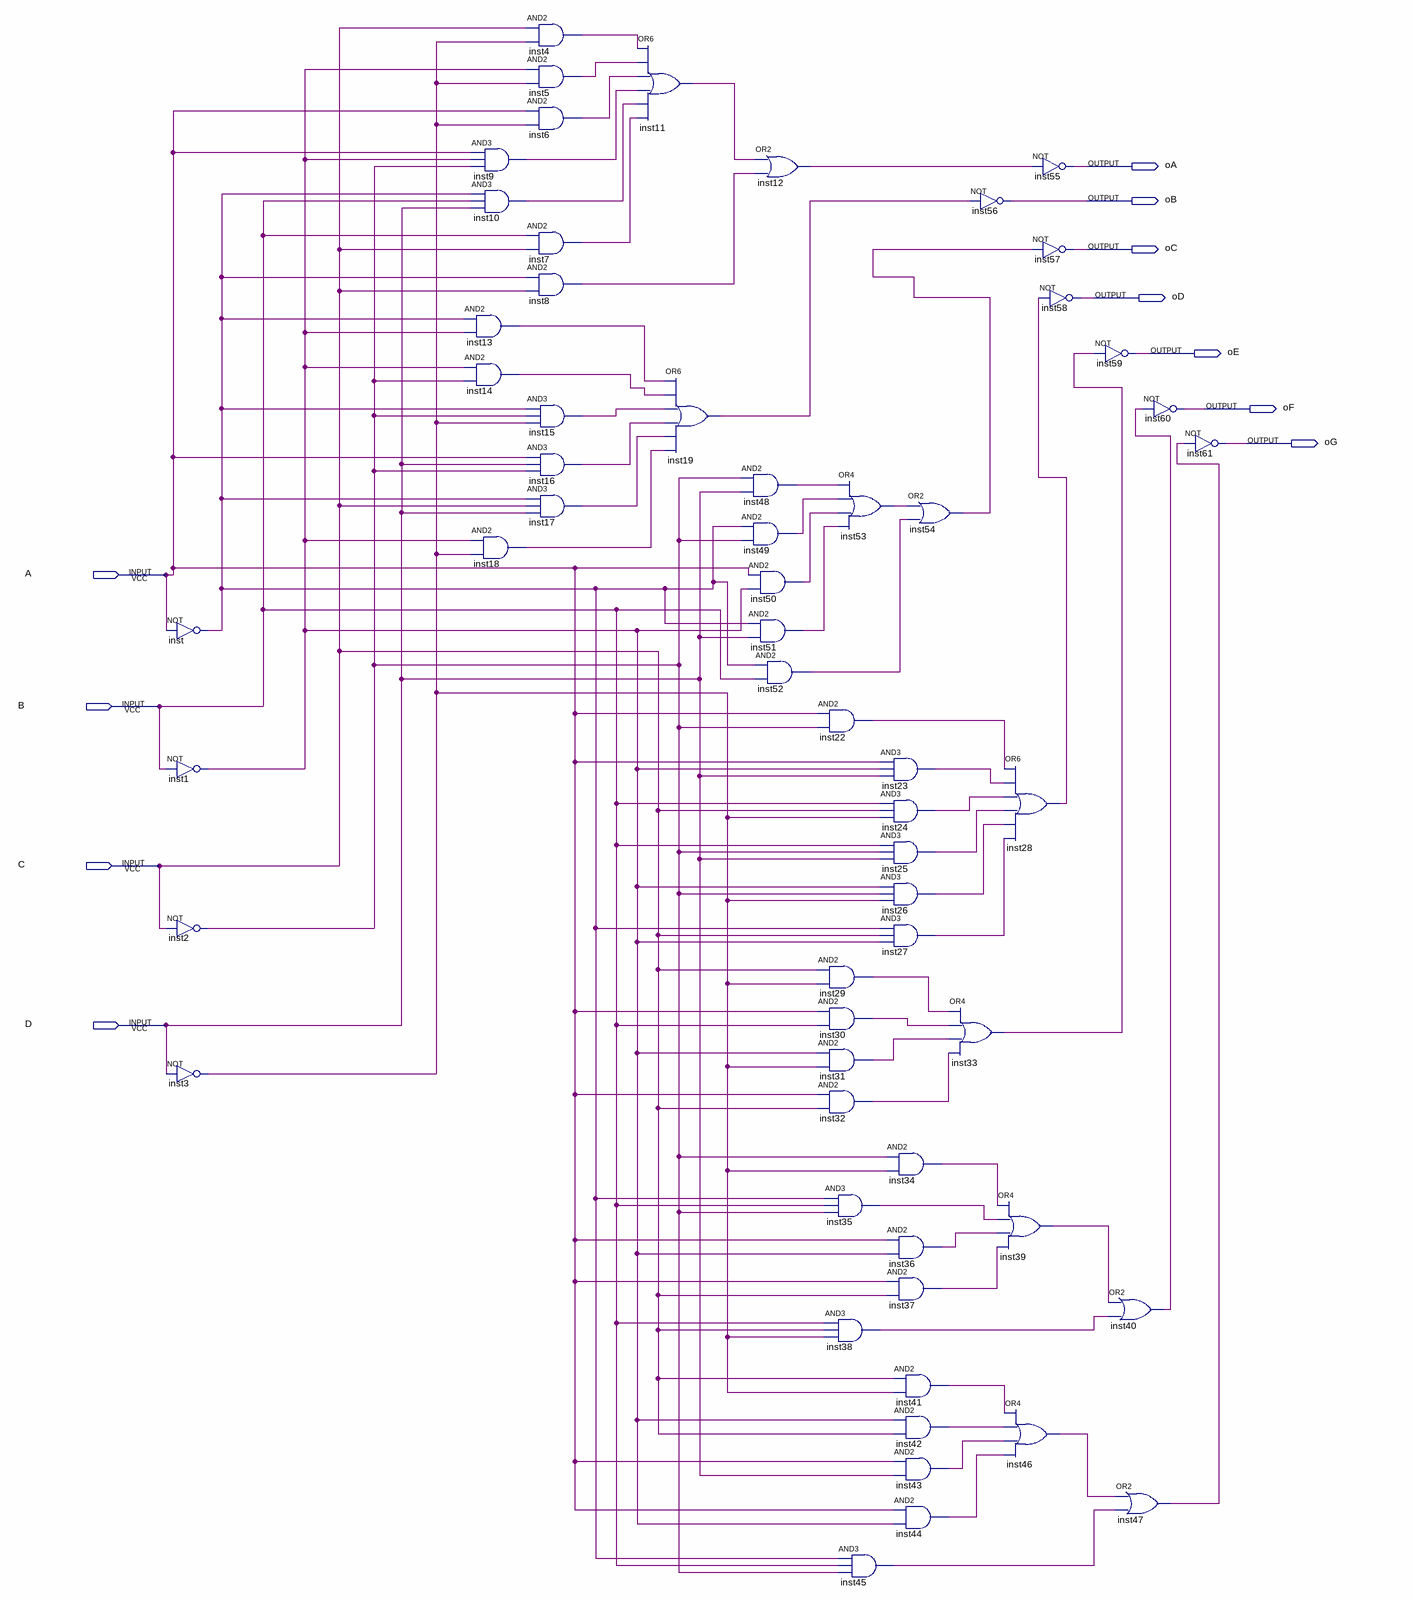
[diagram p0: schematic sheet]
// Quartus schematic lab3bb.bdf as structural Verilog: 60 symbols, 11 pins
module lab3bb (
  input  A,
  input  B,
  input  C,
  input  D,
  output oA,
  output oB,
  output oC,
  output oD,
  output oE,
  output oF,
  output oG
);

  wire inst1_out, inst2_out, inst3_out, inst4_out, inst5_out, inst6_out, inst7_out, inst8_out, inst9_out,
       inst10_out, inst11_out, inst12_out, inst13_out, inst14_out, inst15_out, inst16_out, inst17_out,
       inst18_out, inst19_out, inst22_out, inst23_out, inst24_out, inst25_out, inst26_out, inst27_out,
       inst28_out, inst29_out, inst30_out, inst31_out, inst32_out, inst33_out, inst34_out, inst35_out,
       inst36_out, inst37_out, inst38_out, inst39_out, inst40_out, inst41_out, inst42_out, inst43_out,
       inst44_out, inst45_out, inst46_out, inst47_out, inst48_out, inst49_out, inst50_out, inst51_out,
       inst52_out, inst53_out, inst54_out, inst_out;

  not inst (inst_out, A);
  not inst1 (inst1_out, B);
  not inst2 (inst2_out, C);
  not inst3 (inst3_out, D);
  and inst13 (inst13_out, inst_out, inst1_out);
  and inst14 (inst14_out, inst1_out, inst2_out);
  and inst9 (inst9_out, A, inst1_out, inst2_out);
  and inst10 (inst10_out, inst_out, B, D);
  and inst18 (inst18_out, inst1_out, inst3_out);
  and inst4 (inst4_out, C, inst3_out);
  and inst5 (inst5_out, inst1_out, inst3_out);
  and inst6 (inst6_out, A, inst3_out);
  and inst7 (inst7_out, B, C);
  and inst8 (inst8_out, inst_out, C);
  and inst15 (inst15_out, inst_out, inst2_out, inst3_out);
  and inst16 (inst16_out, A, D, inst2_out);
  and inst17 (inst17_out, inst_out, C, D);
  or inst11 (inst11_out, inst4_out, inst5_out, inst6_out, inst9_out, inst10_out, inst7_out);
  or inst19 (inst19_out, inst13_out, inst14_out, inst15_out, inst16_out, inst17_out, inst18_out);
  and inst48 (inst48_out, inst2_out, D);
  and inst49 (inst49_out, inst_out, inst2_out);
  or inst12 (inst12_out, inst11_out, inst8_out);
  and inst50 (inst50_out, A, inst1_out);
  and inst51 (inst51_out, inst_out, D);
  and inst52 (inst52_out, inst_out, B);
  or inst53 (inst53_out, inst48_out, inst49_out, inst50_out, inst51_out);
  and inst22 (inst22_out, A, inst2_out);
  and inst29 (inst29_out, C, inst3_out);
  and inst30 (inst30_out, A, B);
  and inst31 (inst31_out, inst1_out, inst3_out);
  and inst32 (inst32_out, A, C);
  and inst35 (inst35_out, inst_out, B, inst2_out);
  and inst38 (inst38_out, B, C, inst3_out);
  and inst45 (inst45_out, inst_out, B, inst2_out);
  or inst54 (inst54_out, inst53_out, inst52_out);
  and inst23 (inst23_out, A, inst1_out, D);
  and inst24 (inst24_out, B, C, inst3_out);
  and inst25 (inst25_out, B, inst2_out, D);
  and inst26 (inst26_out, inst1_out, inst2_out, inst3_out);
  and inst27 (inst27_out, inst_out, C, inst1_out);
  and inst34 (inst34_out, inst2_out, inst3_out);
  and inst36 (inst36_out, A, inst1_out);
  and inst37 (inst37_out, A, C);
  and inst41 (inst41_out, C, inst3_out);
  and inst42 (inst42_out, inst1_out, C);
  and inst43 (inst43_out, A, D);
  and inst44 (inst44_out, A, inst1_out);
  or inst33 (inst33_out, inst29_out, inst30_out, inst31_out, inst32_out);
  not inst56 (oB, inst19_out);
  or inst28 (inst28_out, inst22_out, inst23_out, inst24_out, inst25_out, inst26_out, inst27_out);
  or inst39 (inst39_out, inst34_out, inst35_out, inst36_out, inst37_out);
  or inst46 (inst46_out, inst41_out, inst42_out, inst43_out, inst44_out);
  not inst55 (oA, inst12_out);
  not inst57 (oC, inst54_out);
  not inst58 (oD, inst28_out);
  not inst59 (oE, inst33_out);
  or inst40 (inst40_out, inst39_out, inst38_out);
  or inst47 (inst47_out, inst46_out, inst45_out);
  not inst60 (oF, inst40_out);
  not inst61 (oG, inst47_out);
endmodule
